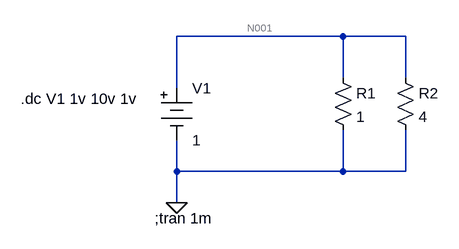
[diagram p0: schematic Yoneda-p40.asc]
Yoneda-p40.asc, the LTspice schematic file:
Version 4
SHEET 1 880 680
WIRE 336 0 80 0
WIRE 432 0 336 0
WIRE 336 64 336 0
WIRE 432 64 432 0
WIRE 80 80 80 0
WIRE 80 208 80 160
WIRE 336 208 336 144
WIRE 336 208 80 208
WIRE 432 208 432 144
WIRE 432 208 336 208
WIRE 80 256 80 208
FLAG 80 256 0
SYMBOL Misc\\battery 80 64 R0
SYMATTR InstName V1
SYMATTR Value 1
SYMBOL res 320 48 R0
SYMATTR InstName R1
SYMATTR Value 1
SYMBOL res 416 48 R0
SYMATTR InstName R2
SYMATTR Value 4
TEXT 46 280 Left 2 !;tran 1m
TEXT -160 96 Left 2 !.dc V1 1v 10v 1v

The netlist it stands for:
* Yoneda-p40.asc
V1 N001 0 1
R1 N001 0 1
R2 N001 0 4
;tran 1m
.dc V1 1v 10v 1v
.backanno
.end

* Results of the author's LTspice run, read from the files saved beside the schematic
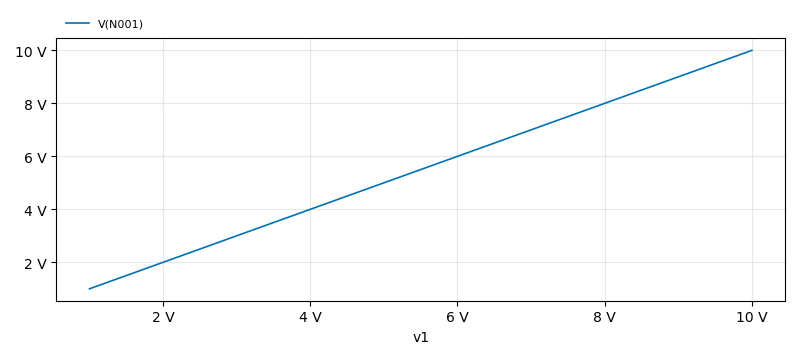
[diagram p1: DC transfer characteristic of Yoneda-p40.asc, plotted from the saved traces]
* DC transfer characteristic, 1 run:
*   V(N001): 1 V at v1=1 V, 10 V at v1=10 V, min 1 V, max 10 V